# Altium schematic sheet Processing.SchDoc
size A; SheetNumber: 1; SheetTotal: 6
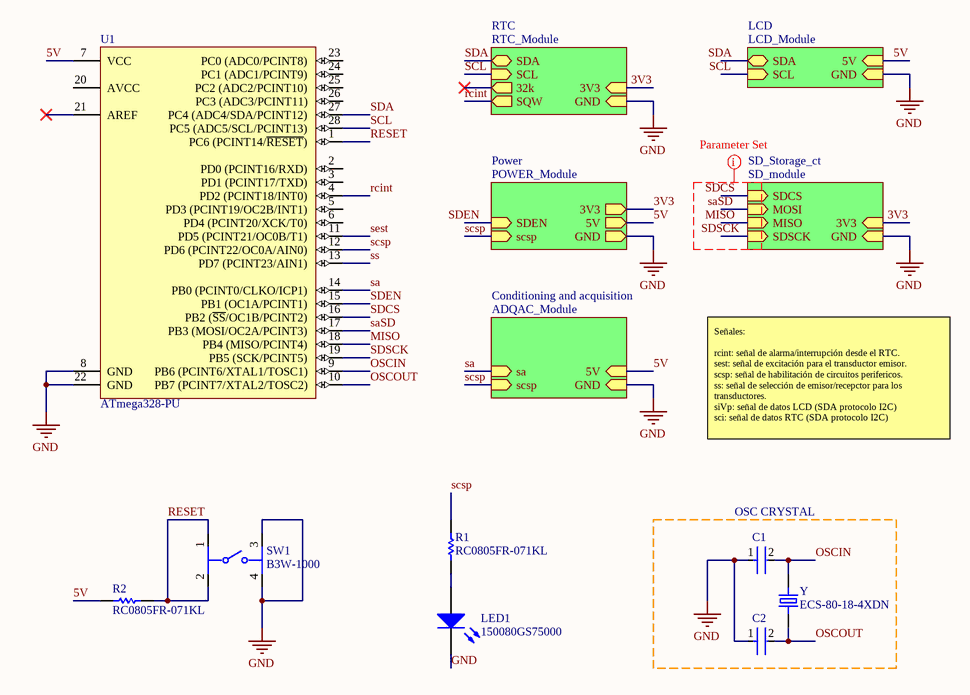
[diagram p0: Processing.SchDoc]

## Parts
C1  C0603C200J5GACTU  [FP-C0603C-CF-MFG]  (value not drawn)
C2  C0603C200J5GACTU  [FP-C0603C-CF-MFG]  (value not drawn)
LED1  150080GS75000  [0805_A]
R1  RC0805FR-071KL  [RESC2013X60X35ML10T20]
R2  RC0805FR-071KL  [RESC2013X60X35ML10T20]
SW1  B3W-1000  [FP-B3W-1000-MFG]
U1  ATmega328-PU  [28P3]
Y  ECS-80-18-4XDN  [XTAL_ECS-80-18-4XDN]

## Blocks framed on the sheet
OSC CRYSTAL: C1 C2 Y

## Sub-sheets
Conditioning and acquisition = ADQAC_Module: GND (in), 5V (in), scsp (in), sa (in)
LCD = LCD_Module: SDA (bidir), SCL (in), 5V (in), GND (in)
Power = POWER_Module: GND (out), scsp (in), 5V (out), 3V3 (out), SDEN (in)
RTC = RTC_Module: 3V3 (in), GND (in), SDA (bidir), SCL (in), 32k (out), SQW (out)
SD_Storage_ct = SD_module: 3V3 (in), GND (in), SDCS (in), MOSI (in), MISO (in), SDSCK (in)

## Nets
GND: C1.1 C2.1 LED1.1(K) SW1.3 SW1.4 U1.8(GND) U1.22(GND) ; sheet SD_Storage_ct/GND, sheet RTC/GND, sheet LCD/GND, sheet Power/GND, sheet Conditioning and acquisition/GND
3V3: sheet SD_Storage_ct/3V3, sheet RTC/3V3, sheet Power/3V3
5V: R2.1 U1.7(VCC) ; sheet LCD/5V, sheet Power/5V, sheet Conditioning and acquisition/5V
MISO: U1.18(PB4_(MISO/PCINT4)) ; sheet SD_Storage_ct/MISO
OSCIN: C1.2 U1.9(PB6_(PCINT6/XTAL1/TOSC1)) Y.2
OSCOUT: C2.2 U1.10(PB7_(PCINT7/XTAL2/TOSC2)) Y.1
rcint: U1.4(PD2_(PCINT18/INT0)) ; sheet RTC/SQW
RESET: R2.2 SW1.1 SW1.2 U1.1(PC6_(PCINT14/~{RESET}))
sa: U1.14(PB0_(PCINT0/CLKO/ICP1)) ; sheet Conditioning and acquisition/sa
saSD: U1.17(PB3_(MOSI/OC2A/PCINT3)) ; sheet SD_Storage_ct/MOSI
SCL: U1.28(PC5_(ADC5/SCL/PCINT13)) ; sheet RTC/SCL, sheet LCD/SCL
scsp: R1.1 U1.12(PD6_(PCINT22/OC0A/AIN0)) ; sheet Power/scsp, sheet Conditioning and acquisition/scsp
SDA: U1.27(PC4_(ADC4/SDA/PCINT12)) ; sheet RTC/SDA, sheet LCD/SDA
SDCS: U1.16(PB2_(~{SS}/OC1B/PCINT2)) ; sheet SD_Storage_ct/SDCS
SDEN: U1.15(PB1_(OC1A/PCINT1)) ; sheet Power/SDEN
SDSCK: U1.19(PB5_(SCK/PCINT5)) ; sheet SD_Storage_ct/SDSCK
sest: U1.11(PD5_(PCINT21/OC0B/T1))
ss: U1.13(PD7_(PCINT23/AIN1))
NetLED1_2: LED1.2(A) R1.2

Not connected (* = marked no-connect by the designer): U1 2(PD0_(PCINT16/RXD)) 3(PD1_(PCINT17/TXD)) 5(PD3_(PCINT19/OC2B/INT1)) 6(PD4_(PCINT20/XCK/T0)) 20(AVCC) 21(AREF)* 23(PC0_(ADC0/PCINT8)) 24(PC1_(ADC1/PCINT9)) 25(PC2_(ADC2/PCINT10)) 26(PC3_(ADC3/PCINT11))

## Layout directives
net class SPI_BUS: MISO, saSD, SDCS, SDSCK

## Notes on the sheet
- Señales:
  rcint: señal de alarma/interrupción desde el RTC.
  sest: señal de excitación para el transductor emisor.
  scsp: señal de habilitación de circuitos perifericos.
  ss: señal de selección de emisor/recepctor para los transductores.
  siVp: señal de datos LCD (SDA protocolo I2C)
  sci: señal de datos RTC (SDA protocolo I2C)

## Library data of the parts
C1 C2 = CMP-1035-00783-3: CAP CER 20PF 50V 5% NP0 0603; Manufacturer: KEMET; Temperature Coefficient: 30ppm/°C; Temperature Characteristic: C0G; Automotive Grade: Grade 1; Tolerance: 0.05; Material: Ceramic; Category: Cap; Manufacturer Part Number: C0603C200J5GACTU; Temperature Range Low: -55°C; RoHS: TRUE; ComponentLink2URL: https://api.kemet.com/component-edge/download/datasheet/C0603C100J5GACAUTO.pdf; Package: C0603C-CF; Height: 0.87mm; Capacitance: 20 pF; Voltage Rating: 50 V; Octopart: https://octopart.com/c0603c200j5gactu-kemet-9138585; Device Class L1: Passive Components; Automotive: Yes; Digikey Description: CAP CER 20PF 50V 5% NP0 0603; Temperature Range High: +125°C; Device Class L3: Ceramic Capacitors; Mouser Description: Multilayer Ceramic Capacitors MLCC - SMD/SMT 50volts 20pF C0G 5%; ComponentLink2Description: Datasheet; Device Class L2: Capacitors; Lead Free: Yes; Temperature: -55°C to +125°C; Value: 20 pF
LED1 = CMP-1426-00007-1: SMD mono-color Chip LED, WL-SMCW, Green; Manufacturer: Wuerth Elektronik; PackageReference: 0805_A; Color: Green; PartNumber: 150080GS75000; ComponentLink2URL: http://katalog.we-online.com/led/datasheet/150080GS75000.pdf; ComponentLink1URL: http://www.we-online.com; ComponentLink1Description: Manufacturer URL; ComponentLink2Description: Datasheet
R1 R2 = CMP-2100-03671-1: Chip Resistor, 1 KOhm, +/- 1%, 125 mW, -55 to 155 degC, 0805 (2012 Metric), RoHS, Tape and Reel; Manufacturer: Yageo; Temperature Coefficient: 100ppm/degreesC; Voltage Rating (DC): 150V; Max Power Dissipation: 125mW; Resistance: 1KOhm; Number of Pins: 2; Number of Terminations: 2; Datasheet URL: http://www.yageo.com/NewPortal/yageodocoutput?fileName=/pdf/R-Chip/PYu-RC_Group_51_RoHS_L_5.pdf; Length: 0.079inch; Package Description: 2-Pin Surface Mounted Device, Body 2 x 1.25 mm; Depth: 1.25mm; Height: 0.024inch; Military Standard: Not; Case/Package: 0805; Package Reference: 0805; RoHSCompliant: true; Lead Free: LeadFree; Packaging: TapeandReel; Package Quantity: 1; Datasheet Version: Rev. 5, 10/2016; Tolerance: 1%; Min Operating Temperature: -55degC; Voltage Rating: 150V; Composition: ThickFilm; Case Code (Imperial): 0805; Power Rating: 125mW; Width: 0.049inch; Case Code (Metric): 2012; Manufacturer URL: http://www.yageo.com/; Max Operating Temperature: 155degC; REACH SVHC: Unknown; Termination: SMD/SMT
SW1 = CMP-08834-000045-1: SWITCH TACTILE SPST-NO 0.05A 24V; Actuator Color: White; Actuator Type: Standard; Current Rating: 50mA; Ratings: IP67; Number of Poles: 1; Illumination Type: Non-Illuminated; Actuator Length: 0.9mm; Switch Function: Off-Mom; Mechanical Life: 1000000Cycles; Throw Configuration: SPST; Operating Force: 1.57N; Contact Resistance: 100mR; Switch Travel: 0.25mm; Mount: Through Hole; Orientation: Straight; Termination: PC Pins; Series: B3W; Max Operating Temperature: 70°C; Contact Plating: Silver; Max Current Rating: 50mA; RoHS Compliant: Yes; Packaging: Bulk; Contact Material: Silver; Length: 6.6mm; Voltage Rating (DC): 24V; Min Operating Temperature: -25°C; Radiation Hardening: No; Package Quantity: 100; Depth: 6.6mm; Max Voltage Rating (DC): 24V; Weight: 0.3g; Insulation Resistance: 100MR; Contact Current Rating: 50mA
U1 = CMP-0095-00015-2: 8-bit AVR Microcontroller, 32KB Flash, 1KB EEPROM, 2KB SRAM, 28-pin PDIP, Industrial Grade (-40°C to 85°C); ComponentLink3Description: ATmega48A/48PA/88A/88PA/168A/168PA/328/328P Summary; RevisionNote: DatasheetVersion updated. URLs added.; DatasheetVersion: revD, May-2011; ComponentLink1URL: http://www.atmel.com/; PackageVersion: revB, Sep-2001; PackageDescription: 28-lead (0.300"/7.62mm Wide) Plastic Dual Inline Package (PDIP); PackageReference: 28P3; ComponentLink1Description: Manufacturer URL; ComponentLink2Description: ATmega48A/48PA/88A/88PA/168A/168PA/328/328P Datasheet; ComponentLink3URL: http://www.atmel.com/dyn/resources/prod_documents/8271S.pdf; ComponentLink2URL: http://www.atmel.com/dyn/resources/prod_documents/8271.pdf
Y = ECS-80-18-4XDN: 8MHz Â±30ppm Crystal 18pF 80 Ohms HC-49/US; MF: ECS Inc.; Digi-Key_Part_Number: X1115-ND; Package: HC-49/US ECS International; Value: *; SnapEDA_Link: https://www.snapeda.com/parts/ECS-80-18-4XDN/ECS%20Inc./view-part/49558/?ref=snap; Digi-Key_Purchase_URL: https://www.digikey.in/product-detail/en/ecs-inc/ECS-80-18-4XDN/X1115-ND/827606?utm_source=snapeda&utm_medium=aggregator&utm_campaign=symbol; MP: ECS-80-18-4XDN